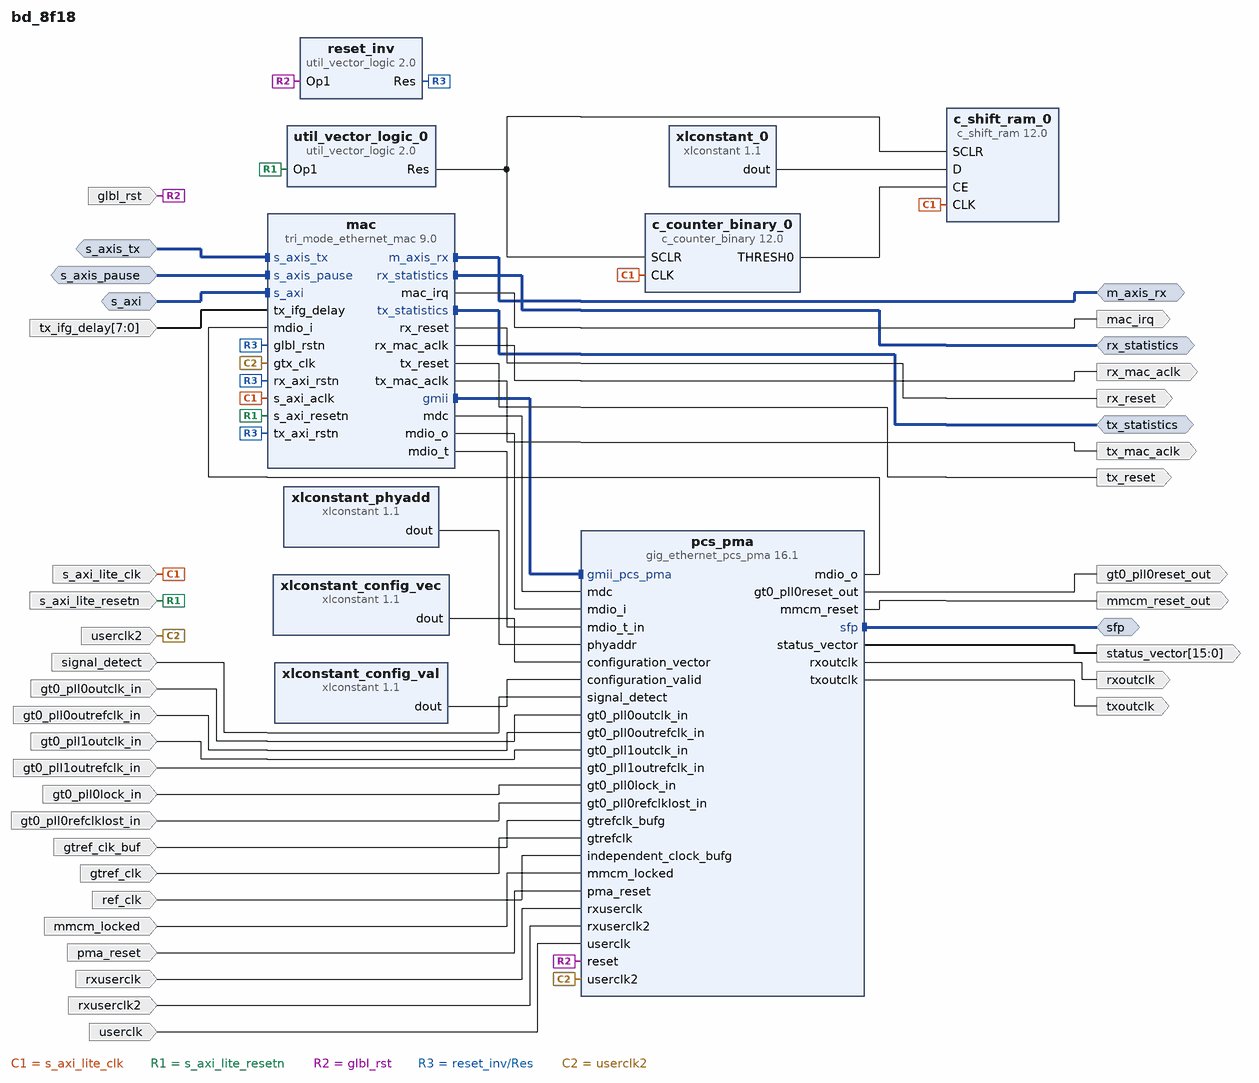
[diagram p0: block diagram of the top level]
# Vivado block design bd_8f18, xc7a200tfbg676-2, Vivado 2019.2
create_bd_design bd_8f18

create_bd_intf_port -mode Slave -vlnv xilinx.com:interface:aximm_rtl:1.0 s_axi
set_property -dict {CONFIG.PROTOCOL AXI4LITE CONFIG.ADDR_WIDTH 17} [get_bd_intf_ports s_axi]
create_bd_intf_port -mode Master -vlnv xilinx.com:interface:axis_rtl:1.0 m_axis_rx
set_property -dict {CONFIG.FREQ_HZ 125000000} [get_bd_intf_ports m_axis_rx]
create_bd_intf_port -mode Slave -vlnv xilinx.com:interface:axis_rtl:1.0 s_axis_tx
set_property -dict {CONFIG.FREQ_HZ 125000000} [get_bd_intf_ports s_axis_tx]
create_bd_intf_port -mode Slave -vlnv xilinx.com:interface:axis_rtl:1.0 s_axis_pause
set_property -dict {CONFIG.FREQ_HZ 125000000} [get_bd_intf_ports s_axis_pause]
create_bd_intf_port -mode Master -vlnv xilinx.com:display_tri_mode_ethernet_mac:statistics_rtl:1.0 tx_statistics
create_bd_intf_port -mode Master -vlnv xilinx.com:display_tri_mode_ethernet_mac:statistics_rtl:1.0 rx_statistics
create_bd_intf_port -mode Master -vlnv xilinx.com:interface:sfp_rtl:1.0 sfp
create_bd_port -dir I -type rst s_axi_lite_resetn
set_property -dict {CONFIG.POLARITY ACTIVE_LOW} [get_bd_ports s_axi_lite_resetn]
create_bd_port -dir I -type clk s_axi_lite_clk
set_property -dict {CONFIG.ASSOCIATED_BUSIF s_axi CONFIG.ASSOCIATED_RESET s_axi_lite_resetn} [get_bd_ports s_axi_lite_clk]
create_bd_port -dir O -type intr mac_irq
set_property -dict {CONFIG.SENSITIVITY EDGE_RISING} [get_bd_ports mac_irq]
create_bd_port -dir O -type clk tx_mac_aclk
set_property -dict [list \
  CONFIG.ASSOCIATED_BUSIF s_axis_pause:s_axis_tx \
  CONFIG.ASSOCIATED_RESET tx_reset \
  CONFIG.FREQ_HZ 125000000 \
] [get_bd_ports tx_mac_aclk]
create_bd_port -dir O -type clk rx_mac_aclk
set_property -dict [list \
  CONFIG.ASSOCIATED_BUSIF m_axis_rx \
  CONFIG.ASSOCIATED_RESET rx_reset \
  CONFIG.FREQ_HZ 125000000 \
] [get_bd_ports rx_mac_aclk]
create_bd_port -dir O -type rst tx_reset
create_bd_port -dir O -type rst rx_reset
create_bd_port -dir I -type rst glbl_rst
set_property -dict {CONFIG.POLARITY ACTIVE_HIGH} [get_bd_ports glbl_rst]
create_bd_port -dir I -from 7 -to 0 tx_ifg_delay
create_bd_port -dir O -from 15 -to 0 status_vector
create_bd_port -dir I signal_detect
create_bd_port -dir I mmcm_locked
create_bd_port -dir O mmcm_reset_out
create_bd_port -dir I -type clk rxuserclk
set_property -dict {CONFIG.FREQ_HZ 62500000} [get_bd_ports rxuserclk]
create_bd_port -dir I -type clk rxuserclk2
set_property -dict {CONFIG.FREQ_HZ 62500000} [get_bd_ports rxuserclk2]
create_bd_port -dir I -type clk userclk
set_property -dict {CONFIG.FREQ_HZ 62500000} [get_bd_ports userclk]
create_bd_port -dir I -type clk userclk2
set_property -dict {CONFIG.FREQ_HZ 125000000} [get_bd_ports userclk2]
create_bd_port -dir I -type rst pma_reset
set_property -dict {CONFIG.POLARITY ACTIVE_HIGH} [get_bd_ports pma_reset]
create_bd_port -dir O -type clk rxoutclk
set_property -dict {CONFIG.FREQ_HZ 62500000} [get_bd_ports rxoutclk]
create_bd_port -dir O -type clk txoutclk
set_property -dict {CONFIG.FREQ_HZ 62500000} [get_bd_ports txoutclk]
create_bd_port -dir I -type clk gt0_pll0outclk_in
create_bd_port -dir I -type clk gt0_pll0outrefclk_in
create_bd_port -dir I -type clk gt0_pll1outclk_in
create_bd_port -dir I -type clk gt0_pll1outrefclk_in
create_bd_port -dir I gt0_pll0lock_in
create_bd_port -dir I gt0_pll0refclklost_in
create_bd_port -dir O -type rst gt0_pll0reset_out
set_property -dict {CONFIG.POLARITY ACTIVE_HIGH} [get_bd_ports gt0_pll0reset_out]
create_bd_port -dir I -type clk gtref_clk
set_property -dict {CONFIG.FREQ_HZ 125000000} [get_bd_ports gtref_clk]
create_bd_port -dir I -type clk gtref_clk_buf
set_property -dict {CONFIG.FREQ_HZ 125000000} [get_bd_ports gtref_clk_buf]
create_bd_port -dir I -type clk ref_clk
set_property -dict {CONFIG.FREQ_HZ 200000000} [get_bd_ports ref_clk]

create_bd_cell -type ip -vlnv xilinx.com:ip:tri_mode_ethernet_mac:9.0 mac
set_property -dict [list \
  CONFIG.Data_Rate 1_Gbps \
  CONFIG.ETHERNET_BOARD_INTERFACE Custom \
  CONFIG.Enable_1588 false \
  CONFIG.Enable_AVB false \
  CONFIG.Enable_MDIO true \
  CONFIG.Enable_Priority_Flow_Control false \
  CONFIG.Frame_Filter true \
  CONFIG.Int_Mode_Type BASEX \
  CONFIG.MAC_Speed 1000_Mbps \
  CONFIG.MDIO_BOARD_INTERFACE Custom \
  CONFIG.Make_MDIO_External false \
  CONFIG.Management_Interface true \
  CONFIG.Number_of_Table_Entries 4 \
  CONFIG.Physical_Interface Internal \
  CONFIG.Statistics_Counters true \
  CONFIG.Statistics_Reset false \
  CONFIG.Statistics_Width 64bit \
  CONFIG.USE_BOARD_FLOW FALSE \
] [get_bd_cells mac]
create_bd_cell -type ip -vlnv xilinx.com:ip:gig_ethernet_pcs_pma:16.1 pcs_pma
set_property -dict [list \
  CONFIG.Auto_Negotiation TRUE \
  CONFIG.ClockSelection Sync \
  CONFIG.DIFFCLK_BOARD_INTERFACE Custom \
  CONFIG.DrpClkRate 50.0 \
  CONFIG.ETHERNET_BOARD_INTERFACE Custom \
  CONFIG.EXAMPLE_SIMULATION 0 \
  CONFIG.EnableAsyncSGMII false \
  CONFIG.Enable_1588 false \
  CONFIG.Ext_Management_Interface true \
  CONFIG.GT_Location X0Y0 \
  CONFIG.GT_Type GTH \
  CONFIG.GTinEx false \
  CONFIG.InstantiateBitslice0 false \
  CONFIG.LvdsRefClk 125 \
  CONFIG.MDIO_BOARD_INTERFACE Custom \
  CONFIG.Management_Interface TRUE \
  CONFIG.MaxDataRate 1G \
  CONFIG.NumOfLanes 1 \
  CONFIG.Physical_Interface Transceiver \
  CONFIG.RefClkRate 125 \
  CONFIG.RefClkSrc clk0 \
  CONFIG.RxLane0_Placement DIFF_PAIR_0 \
  CONFIG.RxNibbleBitslice0Used false \
  CONFIG.SGMII_PHY_Mode FALSE \
  CONFIG.Standard 1000BASEX \
  CONFIG.SupportLevel Include_Shared_Logic_in_Example_Design \
  CONFIG.TransceiverControl false \
  CONFIG.TxLane0_Placement DIFF_PAIR_0 \
  CONFIG.Tx_In_Upper_Nibble 1 \
  CONFIG.USE_BOARD_FLOW false \
] [get_bd_cells pcs_pma]
create_bd_cell -type ip -vlnv xilinx.com:ip:xlconstant:1.1 xlconstant_phyadd
set_property -dict {CONFIG.CONST_VAL 1 CONFIG.CONST_WIDTH 5} [get_bd_cells xlconstant_phyadd]
create_bd_cell -type ip -vlnv xilinx.com:ip:xlconstant:1.1 xlconstant_config_vec
set_property -dict {CONFIG.CONST_VAL 16 CONFIG.CONST_WIDTH 5} [get_bd_cells xlconstant_config_vec]
create_bd_cell -type ip -vlnv xilinx.com:ip:xlconstant:1.1 xlconstant_config_val
set_property -dict {CONFIG.CONST_VAL 1 CONFIG.CONST_WIDTH 1} [get_bd_cells xlconstant_config_val]
create_bd_cell -type ip -vlnv xilinx.com:ip:c_shift_ram:12.0 c_shift_ram_0
set_property -dict [list \
  CONFIG.AsyncInitVal 0 \
  CONFIG.CE true \
  CONFIG.DefaultData 0 \
  CONFIG.Depth 1 \
  CONFIG.SCLR true \
  CONFIG.Width 1 \
] [get_bd_cells c_shift_ram_0]
create_bd_cell -type ip -vlnv xilinx.com:ip:c_counter_binary:12.0 c_counter_binary_0
set_property -dict [list \
  CONFIG.Final_Count_Value 300000 \
  CONFIG.Increment_Value 1 \
  CONFIG.Output_Width 24 \
  CONFIG.Restrict_Count true \
  CONFIG.SCLR true \
  CONFIG.Sync_Threshold_Output true \
  CONFIG.Threshold_Value 300000 \
] [get_bd_cells c_counter_binary_0]
create_bd_cell -type ip -vlnv xilinx.com:ip:xlconstant:1.1 xlconstant_0
create_bd_cell -type ip -vlnv xilinx.com:ip:util_vector_logic:2.0 util_vector_logic_0
set_property -dict {CONFIG.C_OPERATION not CONFIG.C_SIZE 1} [get_bd_cells util_vector_logic_0]
create_bd_cell -type ip -vlnv xilinx.com:ip:util_vector_logic:2.0 reset_inv
set_property -dict {CONFIG.C_OPERATION not CONFIG.C_SIZE 1} [get_bd_cells reset_inv]

# ---- connections ----

connect_bd_intf_net [get_bd_intf_ports m_axis_rx] [get_bd_intf_pins mac/m_axis_rx]
connect_bd_intf_net [get_bd_intf_ports s_axis_tx] [get_bd_intf_pins mac/s_axis_tx]
connect_bd_intf_net [get_bd_intf_ports rx_statistics] [get_bd_intf_pins mac/rx_statistics]
connect_bd_intf_net [get_bd_intf_ports s_axis_pause] [get_bd_intf_pins mac/s_axis_pause]
connect_bd_intf_net [get_bd_intf_pins mac/gmii] [get_bd_intf_pins pcs_pma/gmii_pcs_pma]
connect_bd_intf_net [get_bd_intf_ports sfp] [get_bd_intf_pins pcs_pma/sfp]
connect_bd_intf_net [get_bd_intf_ports tx_statistics] [get_bd_intf_pins mac/tx_statistics]
connect_bd_intf_net [get_bd_intf_ports s_axi] [get_bd_intf_pins mac/s_axi]
connect_bd_net [get_bd_pins c_counter_binary_0/THRESH0] [get_bd_pins c_shift_ram_0/CE]
connect_bd_net [get_bd_pins xlconstant_0/dout] [get_bd_pins c_shift_ram_0/D]
connect_bd_net [get_bd_pins util_vector_logic_0/Res] [get_bd_pins c_shift_ram_0/SCLR] [get_bd_pins c_counter_binary_0/SCLR]
connect_bd_net [get_bd_ports s_axi_lite_clk] [get_bd_pins c_shift_ram_0/CLK] [get_bd_pins c_counter_binary_0/CLK] [get_bd_pins mac/s_axi_aclk]
connect_bd_net [get_bd_ports s_axi_lite_resetn] [get_bd_pins util_vector_logic_0/Op1] [get_bd_pins mac/s_axi_resetn]
connect_bd_net [get_bd_ports glbl_rst] [get_bd_pins reset_inv/Op1] [get_bd_pins pcs_pma/reset]
connect_bd_net [get_bd_pins reset_inv/Res] [get_bd_pins mac/glbl_rstn] [get_bd_pins mac/rx_axi_rstn] [get_bd_pins mac/tx_axi_rstn]
connect_bd_net [get_bd_pins mac/mac_irq] [get_bd_ports mac_irq]
connect_bd_net [get_bd_pins mac/rx_reset] [get_bd_ports rx_reset]
connect_bd_net [get_bd_pins mac/tx_reset] [get_bd_ports tx_reset]
connect_bd_net [get_bd_pins mac/rx_mac_aclk] [get_bd_ports rx_mac_aclk]
connect_bd_net [get_bd_pins mac/tx_mac_aclk] [get_bd_ports tx_mac_aclk]
connect_bd_net [get_bd_ports tx_ifg_delay] [get_bd_pins mac/tx_ifg_delay]
connect_bd_net [get_bd_pins pcs_pma/status_vector] [get_bd_ports status_vector]
connect_bd_net [get_bd_ports signal_detect] [get_bd_pins pcs_pma/signal_detect]
connect_bd_net [get_bd_pins xlconstant_phyadd/dout] [get_bd_pins pcs_pma/phyaddr]
connect_bd_net [get_bd_pins xlconstant_config_vec/dout] [get_bd_pins pcs_pma/configuration_vector]
connect_bd_net [get_bd_pins xlconstant_config_val/dout] [get_bd_pins pcs_pma/configuration_valid]
connect_bd_net [get_bd_pins mac/mdc] [get_bd_pins pcs_pma/mdc]
connect_bd_net [get_bd_pins mac/mdio_o] [get_bd_pins pcs_pma/mdio_i]
connect_bd_net [get_bd_pins mac/mdio_t] [get_bd_pins pcs_pma/mdio_t_in]
connect_bd_net [get_bd_pins pcs_pma/mdio_o] [get_bd_pins mac/mdio_i]
connect_bd_net [get_bd_ports gt0_pll0outclk_in] [get_bd_pins pcs_pma/gt0_pll0outclk_in]
connect_bd_net [get_bd_ports gt0_pll0outrefclk_in] [get_bd_pins pcs_pma/gt0_pll0outrefclk_in]
connect_bd_net [get_bd_ports gt0_pll1outclk_in] [get_bd_pins pcs_pma/gt0_pll1outclk_in]
connect_bd_net [get_bd_ports gt0_pll1outrefclk_in] [get_bd_pins pcs_pma/gt0_pll1outrefclk_in]
connect_bd_net [get_bd_ports gt0_pll0lock_in] [get_bd_pins pcs_pma/gt0_pll0lock_in]
connect_bd_net [get_bd_ports gt0_pll0refclklost_in] [get_bd_pins pcs_pma/gt0_pll0refclklost_in]
connect_bd_net [get_bd_pins pcs_pma/gt0_pll0reset_out] [get_bd_ports gt0_pll0reset_out]
connect_bd_net [get_bd_ports gtref_clk_buf] [get_bd_pins pcs_pma/gtrefclk_bufg]
connect_bd_net [get_bd_pins pcs_pma/mmcm_reset] [get_bd_ports mmcm_reset_out]
connect_bd_net [get_bd_ports gtref_clk] [get_bd_pins pcs_pma/gtrefclk]
connect_bd_net -net userclk2_1 [get_bd_ports userclk2] [get_bd_pins mac/gtx_clk] [get_bd_pins pcs_pma/userclk2]
connect_bd_net [get_bd_ports ref_clk] [get_bd_pins pcs_pma/independent_clock_bufg]
connect_bd_net [get_bd_ports mmcm_locked] [get_bd_pins pcs_pma/mmcm_locked]
connect_bd_net [get_bd_ports pma_reset] [get_bd_pins pcs_pma/pma_reset]
connect_bd_net [get_bd_ports rxuserclk] [get_bd_pins pcs_pma/rxuserclk]
connect_bd_net -net rxuserclk2_1 [get_bd_ports rxuserclk2] [get_bd_pins pcs_pma/rxuserclk2]
connect_bd_net [get_bd_ports userclk] [get_bd_pins pcs_pma/userclk]
connect_bd_net [get_bd_pins pcs_pma/txoutclk] [get_bd_ports txoutclk]
connect_bd_net [get_bd_pins pcs_pma/rxoutclk] [get_bd_ports rxoutclk]

# ---- address map ----
assign_bd_address -offset 0x00000 -range 128K -target_address_space [get_bd_addr_spaces s_axi] [get_bd_addr_segs mac/s_axi/Reg]

validate_bd_design
save_bd_design
